# EAGLE schematic relayWithSubCircuit (EAGLE 7.4.0)
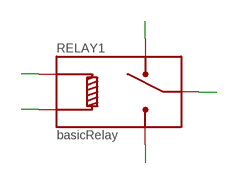
[diagram p0: schematic, sheet 1]

## Parts
RELAY1  basicRelay  RELAY-GENERIC  [RELAY-FINDER-40.51]

## Nets
CENT: RELAY1.CENTER
NCL: RELAY1.NCL
NNEG: RELAY1.N-
NOP: RELAY1.NOP
NPOS: RELAY1.N+

## Library data of the parts
RELAY1 = p.peter-scoville.tests:RELAY-GENERIC; SV_SPICE_ORDER: NOP;CENTER;NCL;N+;N-; SV_SPICE_PREFIX: x; SV_SPICE_SUBCKT: .subckt %NAME% 1 2 3 4 5\nSOpen 1 2 4 5 SW_OPEN on\nSClosed 2 3 4 5 SW_CLOSED on\n.model SW_OPEN SW(Ron=.1 Roff=1Meg Vt=6 )\n.model SW_CLOSED SW(Ron=1Meg Roff=.1 Vt=6 )\n.ends